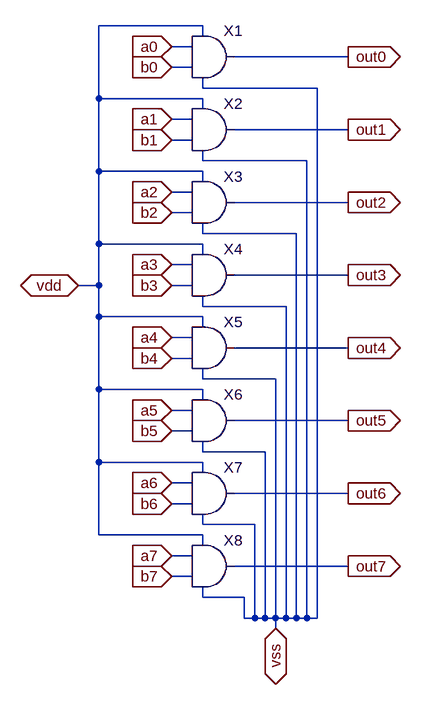
[diagram p0: schematic 8_bit_and.asc]
8_bit_and.asc, the LTspice schematic file:
Version 4
SHEET 1 880 992
WIRE 224 -32 64 -32
WIRE 224 -16 224 -32
WIRE 208 0 176 0
WIRE 448 16 272 16
WIRE 208 32 176 32
WIRE 224 64 224 48
WIRE 400 64 224 64
WIRE 64 80 64 -32
WIRE 224 80 64 80
WIRE 224 96 224 80
WIRE 208 112 176 112
WIRE 448 128 272 128
WIRE 208 144 176 144
WIRE 224 176 224 160
WIRE 384 176 224 176
WIRE 64 192 64 80
WIRE 224 192 64 192
WIRE 224 208 224 192
WIRE 208 224 176 224
WIRE 448 240 272 240
WIRE 208 256 176 256
WIRE 224 288 224 272
WIRE 368 288 224 288
WIRE 64 304 64 192
WIRE 224 304 64 304
WIRE 224 320 224 304
WIRE 208 336 176 336
WIRE 448 352 272 352
WIRE 64 368 64 304
WIRE 64 368 32 368
WIRE 208 368 176 368
WIRE 224 400 224 384
WIRE 352 400 224 400
WIRE 64 416 64 368
WIRE 224 416 64 416
WIRE 224 432 224 416
WIRE 208 448 176 448
WIRE 448 464 272 464
WIRE 208 480 176 480
WIRE 224 512 224 496
WIRE 336 512 224 512
WIRE 64 528 64 416
WIRE 224 528 64 528
WIRE 224 544 224 528
WIRE 208 560 176 560
WIRE 448 576 272 576
WIRE 208 592 176 592
WIRE 224 624 224 608
WIRE 320 624 224 624
WIRE 64 640 64 528
WIRE 224 640 64 640
WIRE 224 656 224 640
WIRE 208 672 176 672
WIRE 448 688 272 688
WIRE 208 704 176 704
WIRE 224 736 224 720
WIRE 304 736 224 736
WIRE 64 752 64 640
WIRE 224 752 64 752
WIRE 224 768 224 752
WIRE 208 784 176 784
WIRE 448 800 272 800
WIRE 208 816 176 816
WIRE 224 848 224 832
WIRE 288 848 224 848
WIRE 288 880 288 848
WIRE 304 880 304 736
WIRE 304 880 288 880
WIRE 320 880 320 624
WIRE 320 880 304 880
WIRE 336 880 336 512
WIRE 336 880 320 880
WIRE 352 880 352 400
WIRE 352 880 336 880
WIRE 368 880 368 288
WIRE 368 880 352 880
WIRE 384 880 384 176
WIRE 384 880 368 880
WIRE 400 880 400 64
WIRE 400 880 384 880
WIRE 336 896 336 880
FLAG 176 0 a0
IOPIN 176 0 In
FLAG 176 32 b0
IOPIN 176 32 In
FLAG 176 112 a1
IOPIN 176 112 In
FLAG 176 144 b1
IOPIN 176 144 In
FLAG 176 256 b2
IOPIN 176 256 In
FLAG 176 224 a2
IOPIN 176 224 In
FLAG 176 368 b3
IOPIN 176 368 In
FLAG 176 336 a3
IOPIN 176 336 In
FLAG 176 480 b4
IOPIN 176 480 In
FLAG 176 448 a4
IOPIN 176 448 In
FLAG 176 592 b5
IOPIN 176 592 In
FLAG 176 560 a5
IOPIN 176 560 In
FLAG 176 704 b6
IOPIN 176 704 In
FLAG 176 672 a6
IOPIN 176 672 In
FLAG 176 816 b7
IOPIN 176 816 In
FLAG 176 784 a7
IOPIN 176 784 In
FLAG 336 896 vss
IOPIN 336 896 BiDir
FLAG 32 368 vdd
IOPIN 32 368 BiDir
FLAG 448 16 out0
IOPIN 448 16 Out
FLAG 448 128 out1
IOPIN 448 128 Out
FLAG 448 240 out2
IOPIN 448 240 Out
FLAG 448 352 out3
IOPIN 448 352 Out
FLAG 448 464 out4
IOPIN 448 464 Out
FLAG 448 576 out5
IOPIN 448 576 Out
FLAG 448 688 out6
IOPIN 448 688 Out
FLAG 448 800 out7
IOPIN 448 800 Out
SYMBOL and 240 -48 R0
SYMATTR InstName X1
SYMBOL and 240 64 R0
SYMATTR InstName X2
SYMBOL and 240 176 R0
SYMATTR InstName X3
SYMBOL and 240 288 R0
SYMATTR InstName X4
SYMBOL and 240 400 R0
SYMATTR InstName X5
SYMBOL and 240 512 R0
SYMATTR InstName X6
SYMBOL and 240 624 R0
SYMATTR InstName X7
SYMBOL and 240 736 R0
SYMATTR InstName X8

The netlist it stands for:
* 8_bit_and.asc
XX1 a0 b0 vdd vss out0 and  ; pins a b vdd vss out
XX2 a1 b1 vdd vss out1 and  ; pins a b vdd vss out
XX3 a2 b2 vdd vss out2 and  ; pins a b vdd vss out
XX4 a3 b3 vdd vss out3 and  ; pins a b vdd vss out
XX5 a4 b4 vdd vss out4 and  ; pins a b vdd vss out
XX6 a5 b5 vdd vss out5 and  ; pins a b vdd vss out
XX7 a6 b6 vdd vss out6 and  ; pins a b vdd vss out
XX8 a7 b7 vdd vss out7 and  ; pins a b vdd vss out
.backanno
.end